# Altium project RoomSensor.PrjPcb
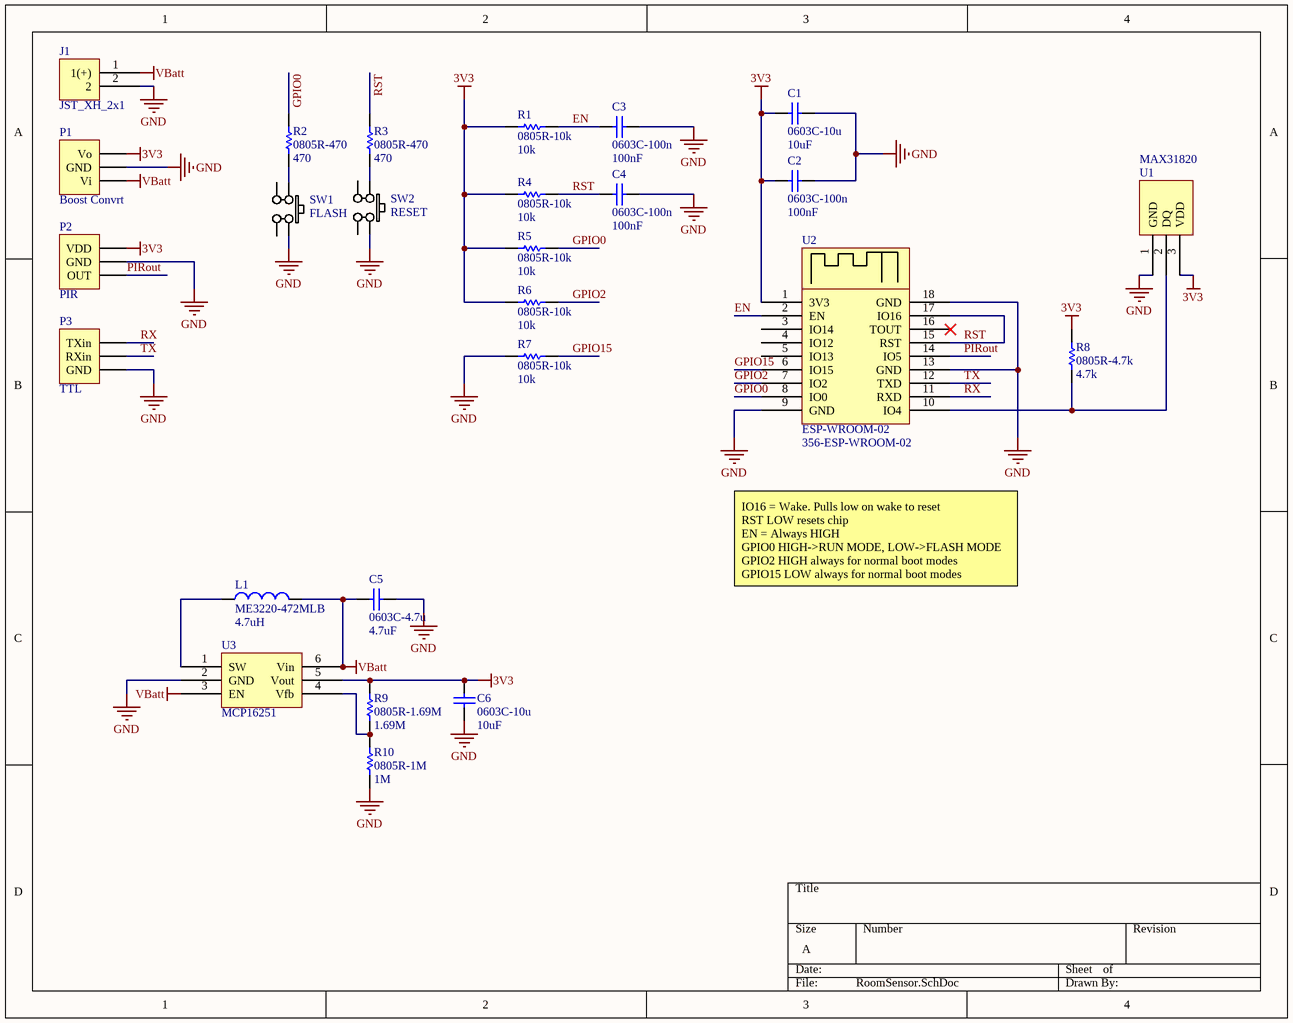
[diagram p0: RoomSensor.SchDoc]
1 sheet, 26 parts. Net scope: global (net labels, ports and power ports of the same name join across sheets).
Board files: RoomSensor.PcbDoc, RoomSensorPanel.PcbDoc

## Sheet RoomSensor.SchDoc
size A

### Parts
C1  0603C-10u  value 10uF  [CHIP_0603]
C2  0603C-100n  value 100nF  [CHIP_0603]
C3  0603C-100n  value 100nF  [CHIP_0603]
C4  0603C-100n  value 100nF  [CHIP_0603]
C5  0603C-4.7u  value 4.7uF  [CHIP_0603]
C6  0603C-10u  value 10uF  [CHIP_0603]
J1  JST_XH_2x1  [JST_XH_2x1]
L1  ME3220-472MLB  value 4.7uH  [ME3220-472MLB]
P1  Boost Convrt  [3x1 Header]
P2  PIR  [HDR1X3]
P3  TTL  [3x1 Header]
R1  0805R-10k  value 10k  [Chip_0805]
R2  0805R-470  value 470  [Chip_0805]
R3  0805R-470  value 470  [Chip_0805]
R4  0805R-10k  value 10k  [Chip_0805]
R5  0805R-10k  value 10k  [Chip_0805]
R6  0805R-10k  value 10k  [Chip_0805]
R7  0805R-10k  value 10k  [Chip_0805]
R8  0805R-4.7k  value 4.7k  [Chip_0805]
R9  0805R-1.69M  value 1.69M  [Chip_0805]
R10  0805R-1M  value 1M  [Chip_0805]
SW1  FLASH  [TL3305AF260QG]
SW2  RESET  [TL3305AF260QG]
U1  MAX31820  [TO-92]
U2  ESP-WROOM-02  Supplier Part Number 1: 356-ESP-WROOM-02  [ESP-WROOM-02]
U3  MCP16251  [SOT23 MCP16251]

### Nets
3V3: C1.1 C2.1 C6.2 P1.1(Vo) P2.1(VDD) R1.1 R4.1 R5.1 R6.1 R8.2 R9.2 U1.3(VDD) U2.1(3V3) U3.5(Vout)
GND: C1.2 C2.2 C3.2 C4.2 C5.2 C6.1 J1.2 P1.2(GND) P2.2(GND) P3.3(GND) R7.1 R10.1 SW1.3 SW2.3 U1.1(GND) U2.9(GND) U2.13(GND) U2.18(GND) U3.2(GND)
VBatt: C5.1 J1.1(1(+)) L1.2 P1.3(Vi) U3.3(EN) U3.6(Vin)
EN: C3.1 R1.2 U2.2(EN)
GPIO0: R2.2 R5.2 U2.8(IO0)
GPIO2: R6.2 U2.7(IO2)
GPIO15: R7.2 U2.6(IO15)
PIRout: P2.3(OUT) U2.14(IO5)
RST: C4.1 R3.2 R4.2 U2.15(RST) U2.17(IO16)
RX: P3.1(TXin) U2.11(RXD)
TX: P3.2(RXin) U2.12(TXD)
NetL1_1: L1.1 U3.1(SW)
NetR2_1: R2.1 SW1.1
NetR3_1: R3.1 SW2.1
NetR8_1: R8.1 U1.2(DQ) U2.10(IO4)
NetR9_1: R9.1 R10.2 U3.4(Vfb)

Not connected (* = marked no-connect by the designer): SW1 2 4; SW2 2 4; U2 3(IO14) 4(IO12) 5(IO13) 16(TOUT)*

### Notes on the sheet
- IO16 = Wake. Pulls low on wake to reset
  RST LOW resets chip
  EN = Always HIGH
  GPIO0 HIGH->RUN MODE, LOW->FLASH MODE
  GPIO2 HIGH always for normal boot modes
  GPIO15 LOW always for normal boot modes

### Library data of the parts
J1 = JST_XH_2x1: JST XH Header 2 pin, 1 row, 2.5mm pitch
L1 = ME3220-472MLB: Code_IEC: 1005; Published: 8-Jun-2000; LatestRevisionDate: 29-May-2009; LatestRevisionNote: IPC-7351 Footprint Added.; PackageReference: 0402-A; Publisher: Altium Limited; PackageDescription: Chip Inductor; Code_JEITA: 0402
P1 P2 = Header 3: Header, 3-Pin; LatestRevisionDate: 17-Jul-2002; LatestRevisionNote: Re-released for DXP Platform.; Publisher: Altium Limited
P3 = Header 3H: Header, 3-Pin, Right Angle; LatestRevisionDate: 17-Jul-2002; LatestRevisionNote: Re-released for DXP Platform.; Publisher: Altium Limited
SW1 SW2 = SW_PB: TL3305AF260QG; Supplier 1: Mouser; Supplier Part Number 1: 612-TL3305AF260QG; Supplier 2: Digi-Key; Supplier Part Number 2: EG5353DKR-ND
U3 = MCP16251T: Supplier 1: Mouser; Supplier 2: Digi-Key; Supplier 3: Digi-Key; Supplier 4: Digi-Key; Supplier Part Number 1: 579-MCP16251T-I/CH; Supplier Part Number 2: MCP16251T-I/CHTR-ND; Supplier Part Number 3: MCP16251T-I/CHCT-ND; Supplier Part Number 4: MCP16251T-I/CHDKR-ND
C1 C6 = 0603C-10u: Published: 8-Jun-2000; LatestRevisionDate: 17-Jul-2002; LatestRevisionNote: Re-released for DXP Platform.; PackageReference: RAD-0.3; Publisher: Altium Limited; PackageDescription: Radial Cap, Thru-Hole; 2 Leads; 0.3 in Pin Spacing; Supplier 1: Digi-Key; Supplier Part Number 1: 587-6012-6-ND; Supplier 2: Mouser; Supplier Part Number 2: 963-JMK107ABJ106KA-T
C2-C4 = 0603C-100n: Published: 8-Jun-2000; LatestRevisionDate: 17-Jul-2002; LatestRevisionNote: Re-released for DXP Platform.; PackageReference: RAD-0.3; Publisher: Altium Limited; PackageDescription: Radial Cap, Thru-Hole; 2 Leads; 0.3 in Pin Spacing; Supplier 1: Mouser; Supplier Part Number 1: 80-C0603C104K8RAC
C5 = 0603C-4.7u: Published: 8-Jun-2000; LatestRevisionDate: 17-Jul-2002; LatestRevisionNote: Re-released for DXP Platform.; PackageReference: RAD-0.3; Publisher: Altium Limited; PackageDescription: Radial Cap, Thru-Hole; 2 Leads; 0.3 in Pin Spacing; Supplier 1: Digi-Key; Supplier Part Number 1: 311-1521-6-ND; Supplier 2: Mouser; Supplier Part Number 2: 603-CC603KRX5R5BB475
R1 R4-R7 = 0805R-10k: Published: 8-Jun-2000; LatestRevisionDate: 17-Jul-2002; LatestRevisionNote: Re-released for DXP Platform.; PackageReference: AXIAL-0.3; Publisher: Altium Limited; PackageDescription: Axial Device, Thru-Hole; 2 Leads; 0.3 in Pin Spacing; Supplier 1: Mouser; Supplier 2: Digi-Key; Supplier 3: Digi-Key; Supplier 4: Digi-Key; Supplier 5: Newark; Supplier 6: Newark; Supplier Part Number 1: 603-RC0805FR-0710KL; Supplier Part Number 2: 311-10.0KCRTR-ND; Supplier Part Number 3: 311-10.0KCRCT-ND; Supplier Part Number 4: 311-10.0KCRDKR-ND; Supplier Part Number 5: 66R2896; Supplier Part Number 6: 68R0229
R2 R3 = 0805R-470: Published: 8-Jun-2000; LatestRevisionDate: 17-Jul-2002; LatestRevisionNote: Re-released for DXP Platform.; PackageReference: AXIAL-0.3; Publisher: Altium Limited; PackageDescription: Axial Device, Thru-Hole; 2 Leads; 0.3 in Pin Spacing; Supplier 1: Mouser; Supplier 2: Digi-Key; Supplier 3: Digi-Key; Supplier 4: Digi-Key; Supplier Part Number 1: 603-RC0805FR-07470RL; Supplier Part Number 2: 311-470CRTR-ND; Supplier Part Number 3: 311-470CRCT-ND; Supplier Part Number 4: 311-470CRDKR-ND
R8 = 0805R-4.7k: Published: 8-Jun-2000; LatestRevisionDate: 17-Jul-2002; LatestRevisionNote: Re-released for DXP Platform.; PackageReference: AXIAL-0.3; Publisher: Altium Limited; PackageDescription: Axial Device, Thru-Hole; 2 Leads; 0.3 in Pin Spacing; Supplier 1: Mouser; Supplier 2: Digi-Key; Supplier 3: Newark; Supplier 4: Digi-Key; Supplier 5: Digi-Key; Supplier 6: Newark; Supplier Part Number 1: 603-RC0805FR-074K7L; Supplier Part Number 2: 311-4.70KCRCT-ND; Supplier Part Number 3: 66R3271; Supplier Part Number 4: 311-4.70KCRTR-ND; Supplier Part Number 5: 311-4.70KCRDKR-ND; Supplier Part Number 6: 68R0243
R9 = 0805R-1.69M: Published: 8-Jun-2000; LatestRevisionDate: 17-Jul-2002; LatestRevisionNote: Re-released for DXP Platform.; PackageReference: AXIAL-0.3; Publisher: Altium Limited; PackageDescription: Axial Device, Thru-Hole; 2 Leads; 0.3 in Pin Spacing; Supplier 1: Mouser; Supplier 2: Digi-Key; Supplier 3: Digi-Key; Supplier Part Number 1: 603-RC0805FR-071M69L; Supplier Part Number 2: 311-1.69MCRCT-ND; Supplier Part Number 3: 311-1.69MCRDKR-ND
R10 = 0805R-1M: Published: 8-Jun-2000; LatestRevisionDate: 17-Jul-2002; LatestRevisionNote: Re-released for DXP Platform.; PackageReference: AXIAL-0.3; Publisher: Altium Limited; PackageDescription: Axial Device, Thru-Hole; 2 Leads; 0.3 in Pin Spacing; Supplier 1: Digi-Key; Supplier 2: Mouser; Supplier 3: Digi-Key; Supplier Part Number 1: 311-1.00MCRCT-ND; Supplier Part Number 2: 603-RC0805FR-071ML; Supplier Part Number 3: 311-1.00MCRDKR-ND
U1 = MAX31820: Supplier 1: Digi-Key; Supplier 2: Mouser; Supplier Part Number 1: MAX31820MCR+-ND; Supplier Part Number 2: 700-MAX31820MCR+
U2 = ESP-WROOM-02: Supplier 1: Mouser